# Altium project Trigger.PrjPCB
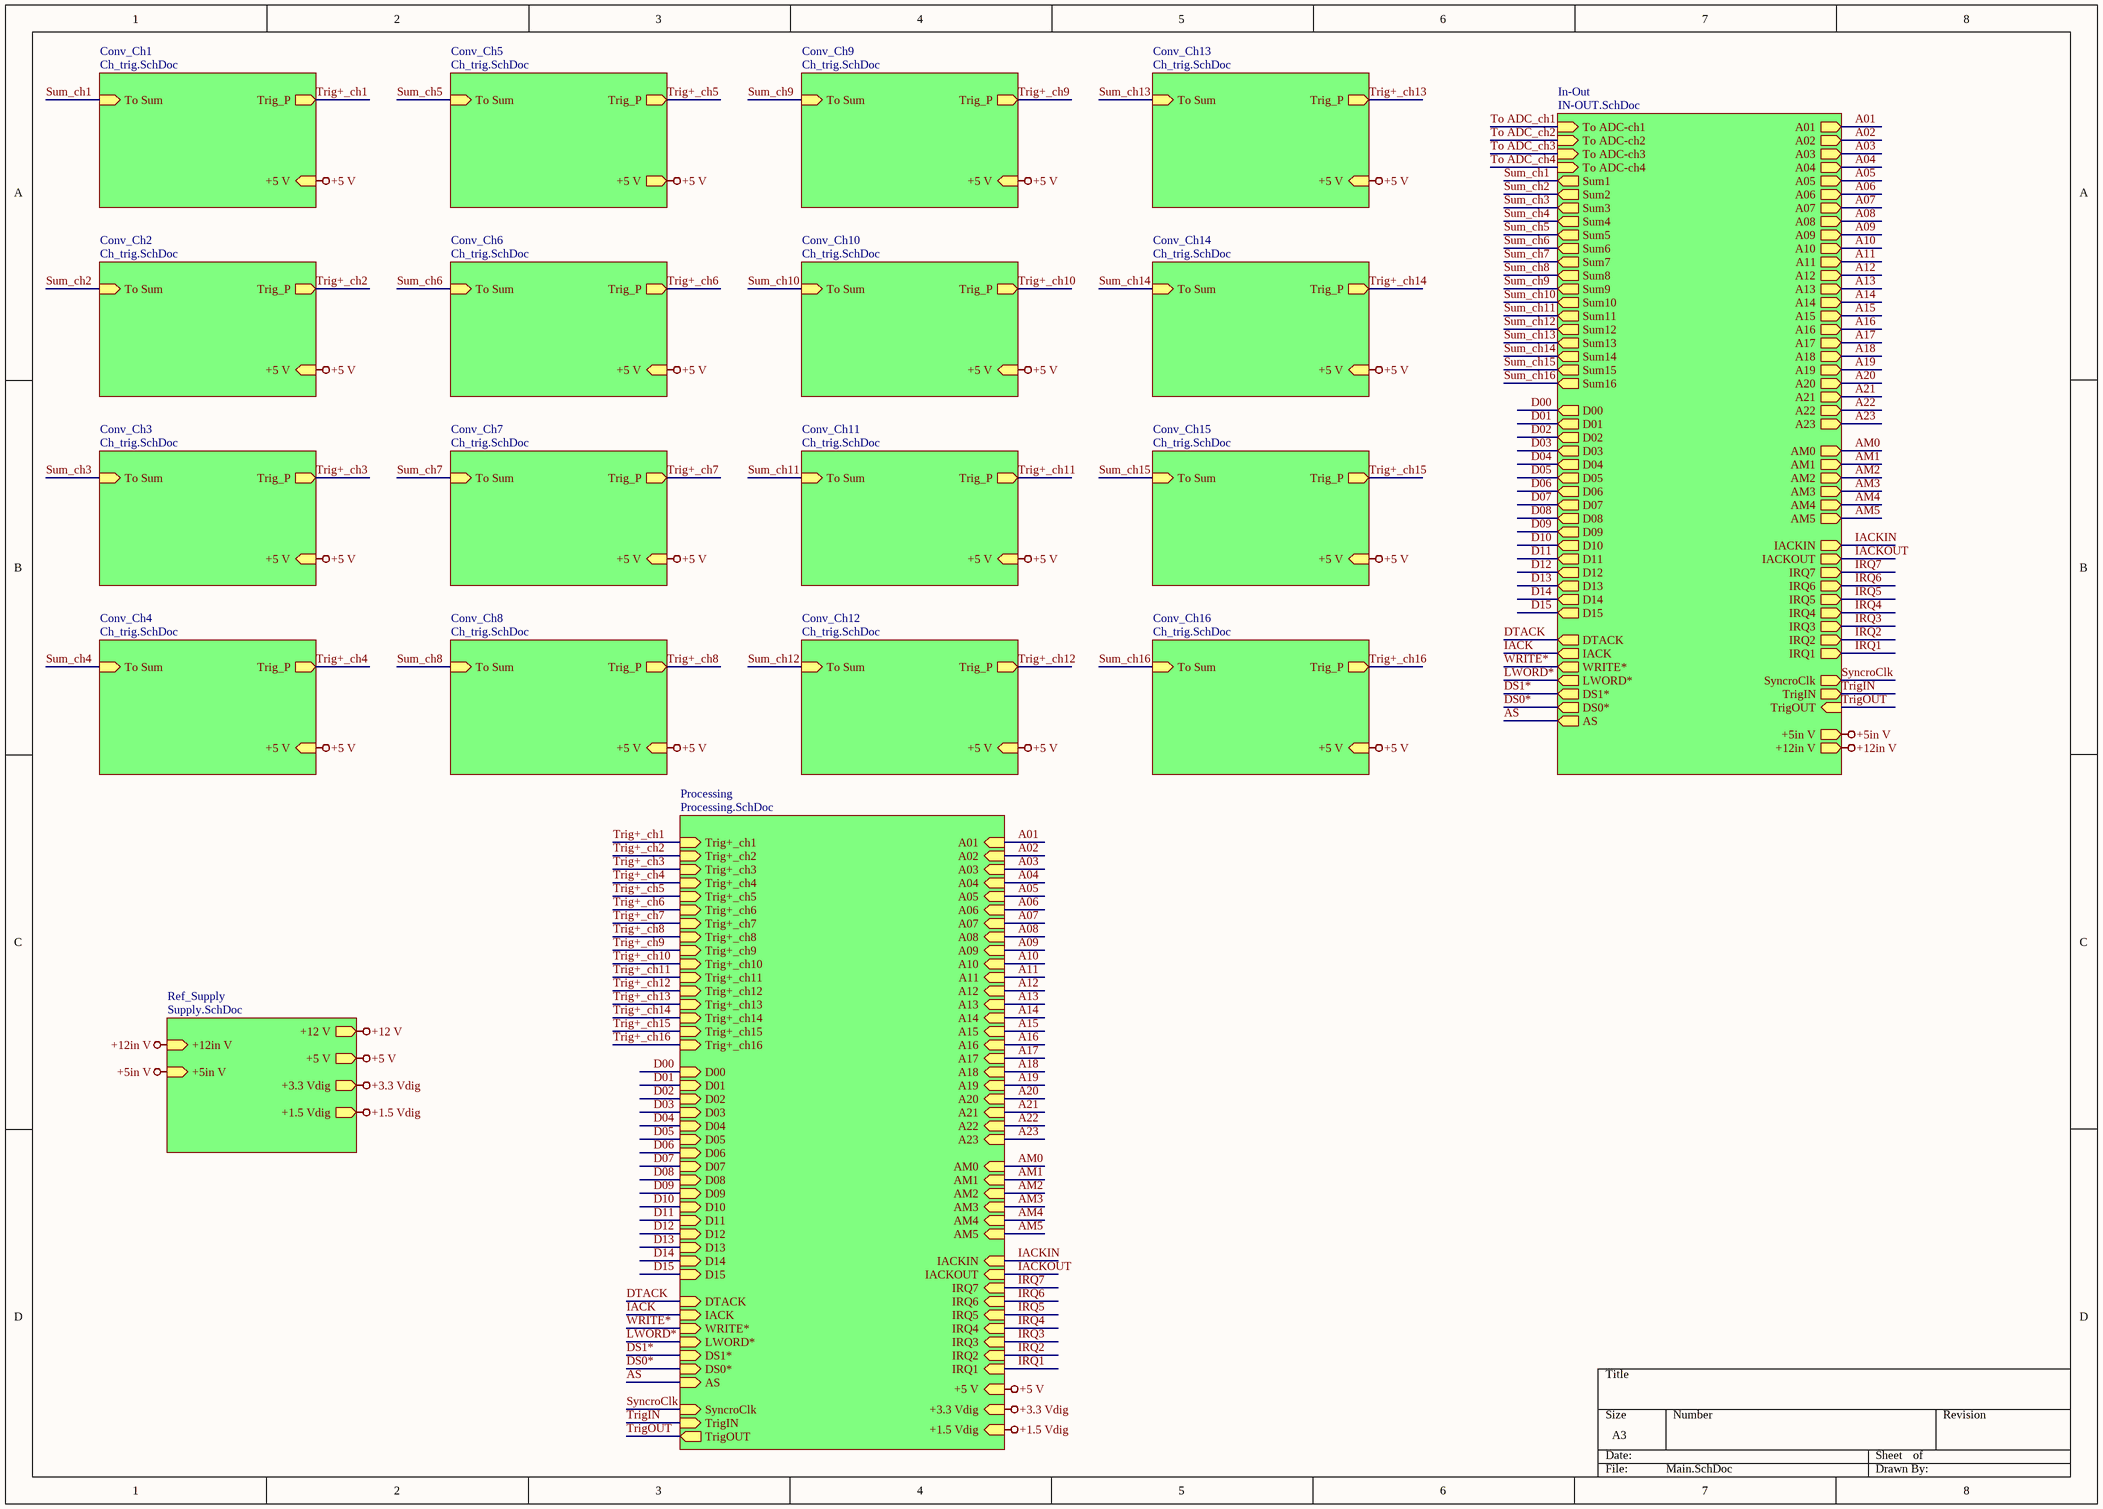
[diagram p0: Main.SchDoc]
5 sheets, 190 parts. Net scope: hierarchical (ports join the sheet entries above them; power ports are global).
Board file: Trigger.PcbDoc
Sheets:
  Main.SchDoc
    Ref_Supply = Supply.SchDoc
    In-Out = In-Out.SchDoc
    Conv_Ch1 = Ch_trig.SchDoc
    Conv_Ch2 = Ch_trig.SchDoc
    Conv_Ch3 = Ch_trig.SchDoc
    Conv_Ch4 = Ch_trig.SchDoc
    Processing = Processing.SchDoc
    Conv_Ch5 = Ch_trig.SchDoc
    Conv_Ch6 = Ch_trig.SchDoc
    Conv_Ch7 = Ch_trig.SchDoc
    Conv_Ch8 = Ch_trig.SchDoc
    Conv_Ch9 = Ch_trig.SchDoc
    Conv_Ch10 = Ch_trig.SchDoc
    Conv_Ch11 = Ch_trig.SchDoc
    Conv_Ch12 = Ch_trig.SchDoc
    Conv_Ch13 = Ch_trig.SchDoc
    Conv_Ch14 = Ch_trig.SchDoc
    Conv_Ch15 = Ch_trig.SchDoc
    Conv_Ch16 = Ch_trig.SchDoc

## Sheet Main.SchDoc
size A3

### Sub-sheets
Conv_Ch1 = Ch_trig.SchDoc: To Sum (in), Trig_P (out), +5 V (in)
Conv_Ch2 = Ch_trig.SchDoc: To Sum (in), Trig_P (out), +5 V (in)
Conv_Ch3 = Ch_trig.SchDoc: To Sum (in), Trig_P (out), +5 V (in)
Conv_Ch4 = Ch_trig.SchDoc: To Sum (in), Trig_P (out), +5 V (in)
Conv_Ch5 = Ch_trig.SchDoc: To Sum (in), Trig_P (out), +5 V (out)
Conv_Ch6 = Ch_trig.SchDoc: To Sum (in), Trig_P (out), +5 V (in)
Conv_Ch7 = Ch_trig.SchDoc: To Sum (in), Trig_P (out), +5 V (in)
Conv_Ch8 = Ch_trig.SchDoc: To Sum (in), Trig_P (out), +5 V (in)
Conv_Ch9 = Ch_trig.SchDoc: To Sum (in), Trig_P (out), +5 V (in)
Conv_Ch10 = Ch_trig.SchDoc: To Sum (in), Trig_P (out), +5 V (in)
Conv_Ch11 = Ch_trig.SchDoc: To Sum (in), Trig_P (out), +5 V (in)
Conv_Ch12 = Ch_trig.SchDoc: To Sum (in), Trig_P (out), +5 V (in)
Conv_Ch13 = Ch_trig.SchDoc: To Sum (in), Trig_P (out), +5 V (in)
Conv_Ch14 = Ch_trig.SchDoc: To Sum (in), Trig_P (out), +5 V (in)
Conv_Ch15 = Ch_trig.SchDoc: To Sum (in), Trig_P (out), +5 V (in)
Conv_Ch16 = Ch_trig.SchDoc: To Sum (in), Trig_P (out), +5 V (in)
In-Out = IN-OUT.SchDoc: To ADC-ch1 (in), To ADC-ch2 (in), To ADC-ch3 (in), To ADC-ch4 (in), Sum4 (out), Sum3 (out), Sum2 (out), Sum1 (out), Sum8 (out), Sum7 (out), Sum6 (out), Sum5 (out), Sum12 (out), Sum11 (out), Sum10 (out), Sum9 (out), Sum16 (out), Sum15 (out), Sum14 (out), Sum13 (out), A01 (out), A02 (out), A03 (out), A04 (out), A05 (out), A06 (out), A07 (out), A08 (out), A09 (out), A10 (out), A11 (out), A12 (out), A13 (out), A14 (out), A15 (out), A16 (out), A18 (out), A19 (out), A20 (out), A21 (out), A22 (out), A23 (out), IRQ7 (out), AM0 (out), AM1 (out), AM2 (out), AM3 (out), AM4 (out), AM5 (out), IRQ6 (out), IACKIN (out), IACKOUT (out), IRQ4 (out), IRQ3 (out), IRQ2 (out), IRQ1 (out), +5in V (out), +12in V (out), IRQ5 (out), A17 (out), D01 (out), D02 (out), D03 (out), D04 (out), D05 (out), D06 (out), D07 (out), D08 (out), D09 (out), D00 (out), D11 (out), D12 (out), D13 (out), D14 (out), D15 (out), D10 (out), DTACK (out), IACK (out), WRITE* (out), LWORD* (out), DS1* (out), DS0* (out), AS (out), TrigOUT (in), SyncroClk (out), TrigIN (out)
Processing = Processing.SchDoc: Trig+_ch1 (in), Trig+_ch2 (in), Trig+_ch3 (in), Trig+_ch4 (in), Trig+_ch5 (in), Trig+_ch6 (in), Trig+_ch7 (in), Trig+_ch8 (in), Trig+_ch9 (in), Trig+_ch10 (in), Trig+_ch11 (in), Trig+_ch12 (in), Trig+_ch13 (in), Trig+_ch14 (in), Trig+_ch15 (in), Trig+_ch16 (in), D01 (in), D02 (in), D03 (in), D04 (in), D05 (in), D06 (in), D07 (in), D08 (in), D09 (in), D00 (in), D11 (in), D12 (in), D13 (in), D14 (in), D15 (in), D10 (in), A01 (in), A02 (in), A03 (in), A04 (in), A05 (in), A06 (in), A07 (in), A08 (in), A09 (in), A10 (in), A11 (in), A12 (in), A13 (in), A14 (in), A15 (in), A16 (in), A18 (in), A19 (in), A20 (in), A21 (in), A22 (in), A23 (in), IRQ7 (in), AM0 (in), AM1 (in), AM2 (in), AM3 (in), AM4 (in), AM5 (in), IRQ6 (in), IACKIN (in), IACKOUT (in), DTACK (in), IACK (in), WRITE* (in), LWORD* (in), DS1* (in), DS0* (in), AS (in), IRQ4 (in), IRQ3 (in), IRQ2 (in), IRQ1 (in), +1.5 Vdig (in), +5 V (in), +3.3 Vdig (in), IRQ5 (in), A17 (in), TrigOUT (out), SyncroClk (in), TrigIN (in)
Ref_Supply = Supply.SchDoc: +1.5 Vdig (out), +5 V (out), +3.3 Vdig (out), +12 V (out), +5in V (in), +12in V (in)

### Nets
+1.5 Vdig: sheet Ref_Supply/+1.5 Vdig, sheet Processing/+1.5 Vdig
+3.3 Vdig: sheet Ref_Supply/+3.3 Vdig, sheet Processing/+3.3 Vdig
+5 V: sheet Ref_Supply/+5 V, sheet Conv_Ch1/+5 V, sheet Conv_Ch2/+5 V, sheet Conv_Ch3/+5 V, sheet Conv_Ch4/+5 V, sheet Processing/+5 V, sheet Conv_Ch5/+5 V, sheet Conv_Ch6/+5 V, sheet Conv_Ch7/+5 V, sheet Conv_Ch8/+5 V, sheet Conv_Ch9/+5 V, sheet Conv_Ch10/+5 V, sheet Conv_Ch11/+5 V, sheet Conv_Ch12/+5 V, sheet Conv_Ch13/+5 V, sheet Conv_Ch14/+5 V, sheet Conv_Ch15/+5 V, sheet Conv_Ch16/+5 V
+5in V: sheet Ref_Supply/+5in V, sheet In-Out/+5in V
+12in V: sheet Ref_Supply/+12in V, sheet In-Out/+12in V
A01: sheet In-Out/A01, sheet Processing/A01
A02: sheet In-Out/A02, sheet Processing/A02
A03: sheet In-Out/A03, sheet Processing/A03
A04: sheet In-Out/A04, sheet Processing/A04
A05: sheet In-Out/A05, sheet Processing/A05
A06: sheet In-Out/A06, sheet Processing/A06
A07: sheet In-Out/A07, sheet Processing/A07
A08: sheet In-Out/A08, sheet Processing/A08
A09: sheet In-Out/A09, sheet Processing/A09
A10: sheet In-Out/A10, sheet Processing/A10
A11: sheet In-Out/A11, sheet Processing/A11
A12: sheet In-Out/A12, sheet Processing/A12
A13: sheet In-Out/A13, sheet Processing/A13
A14: sheet In-Out/A14, sheet Processing/A14
A15: sheet In-Out/A15, sheet Processing/A15
A16: sheet In-Out/A16, sheet Processing/A16
A17: sheet In-Out/A17, sheet Processing/A17
A18: sheet In-Out/A18, sheet Processing/A18
A19: sheet In-Out/A19, sheet Processing/A19
A20: sheet In-Out/A20, sheet Processing/A20
A21: sheet In-Out/A21, sheet Processing/A21
A22: sheet In-Out/A22, sheet Processing/A22
A23: sheet In-Out/A23, sheet Processing/A23
AM0: sheet In-Out/AM0, sheet Processing/AM0
AM1: sheet In-Out/AM1, sheet Processing/AM1
AM2: sheet In-Out/AM2, sheet Processing/AM2
AM3: sheet In-Out/AM3, sheet Processing/AM3
AM4: sheet In-Out/AM4, sheet Processing/AM4
AM5: sheet In-Out/AM5, sheet Processing/AM5
AS: sheet In-Out/AS, sheet Processing/AS
D00: sheet In-Out/D00, sheet Processing/D00
D01: sheet In-Out/D01, sheet Processing/D01
D02: sheet In-Out/D02, sheet Processing/D02
D03: sheet In-Out/D03, sheet Processing/D03
D04: sheet In-Out/D04, sheet Processing/D04
D05: sheet In-Out/D05, sheet Processing/D05
D06: sheet In-Out/D06, sheet Processing/D06
D07: sheet In-Out/D07, sheet Processing/D07
D08: sheet In-Out/D08, sheet Processing/D08
D09: sheet In-Out/D09, sheet Processing/D09
D10: sheet In-Out/D10, sheet Processing/D10
D11: sheet In-Out/D11, sheet Processing/D11
D12: sheet In-Out/D12, sheet Processing/D12
D13: sheet In-Out/D13, sheet Processing/D13
D14: sheet In-Out/D14, sheet Processing/D14
D15: sheet In-Out/D15, sheet Processing/D15
DS0*: sheet In-Out/DS0*, sheet Processing/DS0*
DS1*: sheet In-Out/DS1*, sheet Processing/DS1*
DTACK: sheet In-Out/DTACK, sheet Processing/DTACK
IACK: sheet In-Out/IACK, sheet Processing/IACK
IACKIN: sheet In-Out/IACKIN, sheet Processing/IACKIN
IACKOUT: sheet In-Out/IACKOUT, sheet Processing/IACKOUT
IRQ1: sheet In-Out/IRQ1, sheet Processing/IRQ1
IRQ2: sheet In-Out/IRQ2, sheet Processing/IRQ2
IRQ3: sheet In-Out/IRQ3, sheet Processing/IRQ3
IRQ4: sheet In-Out/IRQ4, sheet Processing/IRQ4
IRQ5: sheet In-Out/IRQ5, sheet Processing/IRQ5
IRQ6: sheet In-Out/IRQ6, sheet Processing/IRQ6
IRQ7: sheet In-Out/IRQ7, sheet Processing/IRQ7
LWORD*: sheet In-Out/LWORD*, sheet Processing/LWORD*
Sum_ch1: sheet In-Out/Sum1, sheet Conv_Ch1/To Sum
Sum_ch2: sheet In-Out/Sum2, sheet Conv_Ch2/To Sum
Sum_ch3: sheet In-Out/Sum3, sheet Conv_Ch3/To Sum
Sum_ch4: sheet In-Out/Sum4, sheet Conv_Ch4/To Sum
Sum_ch5: sheet In-Out/Sum5, sheet Conv_Ch5/To Sum
Sum_ch6: sheet In-Out/Sum6, sheet Conv_Ch6/To Sum
Sum_ch7: sheet In-Out/Sum7, sheet Conv_Ch7/To Sum
Sum_ch8: sheet In-Out/Sum8, sheet Conv_Ch8/To Sum
Sum_ch9: sheet In-Out/Sum9, sheet Conv_Ch9/To Sum
Sum_ch10: sheet In-Out/Sum10, sheet Conv_Ch10/To Sum
Sum_ch11: sheet In-Out/Sum11, sheet Conv_Ch11/To Sum
Sum_ch12: sheet In-Out/Sum12, sheet Conv_Ch12/To Sum
Sum_ch13: sheet In-Out/Sum13, sheet Conv_Ch13/To Sum
Sum_ch14: sheet In-Out/Sum14, sheet Conv_Ch14/To Sum
Sum_ch15: sheet In-Out/Sum15, sheet Conv_Ch15/To Sum
Sum_ch16: sheet In-Out/Sum16, sheet Conv_Ch16/To Sum
SyncroClk: sheet In-Out/SyncroClk, sheet Processing/SyncroClk
To ADC_ch1: sheet In-Out/To ADC-ch1
To ADC_ch2: sheet In-Out/To ADC-ch2
To ADC_ch3: sheet In-Out/To ADC-ch3
To ADC_ch4: sheet In-Out/To ADC-ch4
Trig+_ch1: sheet Conv_Ch1/Trig_P, sheet Processing/Trig+_ch1
Trig+_ch2: sheet Conv_Ch2/Trig_P, sheet Processing/Trig+_ch2
Trig+_ch3: sheet Conv_Ch3/Trig_P, sheet Processing/Trig+_ch3
Trig+_ch4: sheet Conv_Ch4/Trig_P, sheet Processing/Trig+_ch4
Trig+_ch5: sheet Processing/Trig+_ch5, sheet Conv_Ch5/Trig_P
Trig+_ch6: sheet Processing/Trig+_ch6, sheet Conv_Ch6/Trig_P
Trig+_ch7: sheet Processing/Trig+_ch7, sheet Conv_Ch7/Trig_P
Trig+_ch8: sheet Processing/Trig+_ch8, sheet Conv_Ch8/Trig_P
Trig+_ch9: sheet Processing/Trig+_ch9, sheet Conv_Ch9/Trig_P
Trig+_ch10: sheet Processing/Trig+_ch10, sheet Conv_Ch10/Trig_P
Trig+_ch11: sheet Processing/Trig+_ch11, sheet Conv_Ch11/Trig_P
Trig+_ch12: sheet Processing/Trig+_ch12, sheet Conv_Ch12/Trig_P
Trig+_ch13: sheet Processing/Trig+_ch13, sheet Conv_Ch13/Trig_P
Trig+_ch14: sheet Processing/Trig+_ch14, sheet Conv_Ch14/Trig_P
Trig+_ch15: sheet Processing/Trig+_ch15, sheet Conv_Ch15/Trig_P
Trig+_ch16: sheet Processing/Trig+_ch16, sheet Conv_Ch16/Trig_P
TrigIN: sheet In-Out/TrigIN, sheet Processing/TrigIN
TrigOUT: sheet In-Out/TrigOUT, sheet Processing/TrigOUT
WRITE*: sheet In-Out/WRITE*, sheet Processing/WRITE*

## Sheet Supply.SchDoc
size A4
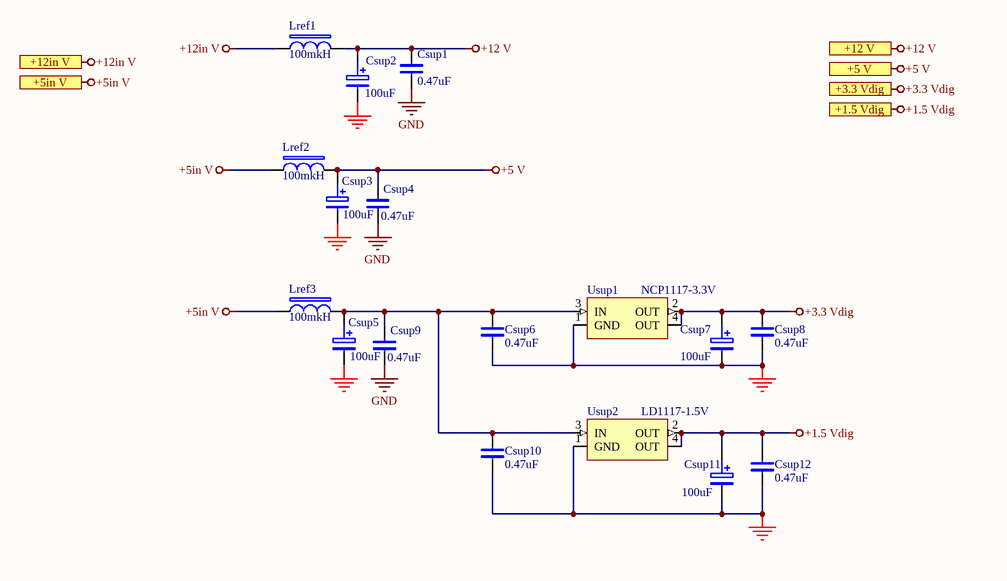
[diagram p1: Supply.SchDoc]

### Parts
Csup1  0.47uF  [chip0805]
Csup2  100uF  [CEL-SMD300]
Csup3  100uF  [CEL-SMD300]
Csup4  0.47uF  [chip0805]
Csup5  100uF  [CEL-SMD300]
Csup6  0.47uF  [chip0805]
Csup7  100uF  [CEL-SMD300]
Csup8  0.47uF  [chip0805]
Csup9  0.47uF  [chip0805]
Csup10  0.47uF  [chip0805]
Csup11  100uF  [CEL-SMD300]
Csup12  0.47uF  [chip0805]
Lref1  100mkH  [SDR0604]
Lref2  100mkH  [SDR0604]
Lref3  100mkH  [SDR0604]
Usup1  NCP1117-3.3V  [TO-252]
Usup2  LD1117-1.5V  [TO-252]

### Ports
+1.5 Vdig (out), +3.3 Vdig (out), +5 V (out), +5in V (in), +12 V (out), +12in V (in)

### Nets
+1.5 Vdig: Csup11.+ Csup12.1 Usup2.2(OUT) Usup2.4(OUT) ; port +1.5 Vdig
+3.3 Vdig: Csup7.+ Csup8.1 Usup1.2(OUT) Usup1.4(OUT) ; port +3.3 Vdig
+5 V: Csup3.+ Csup4.1 Lref2.2 ; port +5 V
+5in V: Lref2.1 Lref3.1 ; port +5in V
+12 V: Csup1.1 Csup2.+ Lref1.2 ; port +12 V
+12in V: Lref1.1 ; port +12in V
GND: Csup1.2 Csup2.- Csup3.- Csup4.2 Csup5.- Csup6.2 Csup7.- Csup8.2 Csup9.2 Csup10.2 Csup11.- Csup12.2 Usup1.1(GND) Usup2.1(GND)
NetCsup5_+: Csup5.+ Csup6.1 Csup9.1 Csup10.1 Lref3.2 Usup1.3(IN) Usup2.3(IN)

### Library data of the parts
Csup1 Csup4 Csup6 Csup8-Csup10 Csup12 = C: Text Field1: 20; Text Field2: 10
Csup2 Csup3 Csup5 Csup7 Csup11 = C POL: Text Field1: 20; Text Field2: 20
Lref1-Lref3 = DR: Text Field1: 30; Text Field2: 10
Usup2 = NCP1117-3.3V

## Sheet In-Out.SchDoc
size A4
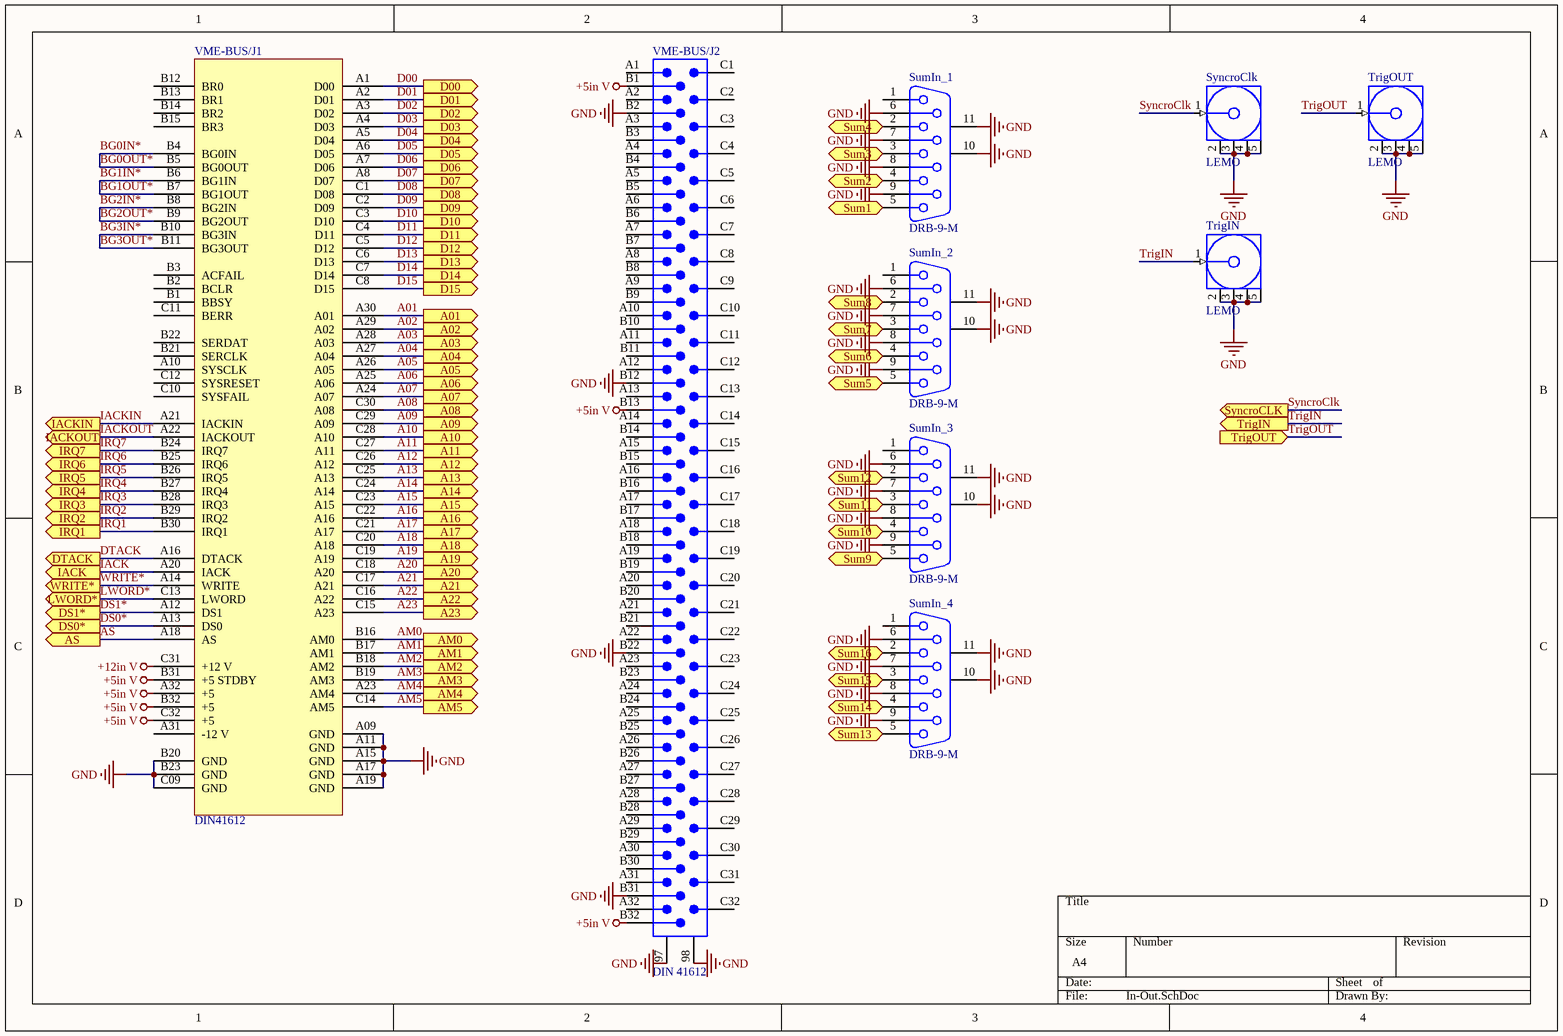
[diagram p2: In-Out.SchDoc]

### Parts
SumIn_1  DRB-9-M  [DSUB1.385-2H9]
SumIn_2  DRB-9-M  [DSUB1.385-2H9]
SumIn_3  DRB-9-M  [DSUB1.385-2H9]
SumIn_4  DRB-9-M  [DSUB1.385-2H9]
SyncroClk  LEMO  [LEMO]
TrigIN  LEMO  [LEMO]
TrigOUT  LEMO  [LEMO]
VME-BUS/J1  DIN41612  [EURO2.54-2H96]
VME-BUS/J2  DIN 41612  [EURO2.54-2H96]

### Ports
A01 (out), A02 (out), A03 (out), A04 (out), A05 (out), A06 (out), A07 (out), A08 (out), A09 (out), A10 (out), A11 (out), A12 (out), A13 (out), A14 (out), A15 (out), A16 (out), A17 (out), A18 (out), A19 (out), A20 (out), A21 (out), A22 (out), A23 (out), AM0 (out), AM1 (out), AM2 (out), AM3 (out), AM4 (out), AM5 (out), AS (out), D00 (out), D01 (out), D02 (out), D03 (out), D04 (out), D05 (out), D06 (out), D07 (out), D08 (out), D09 (out), D10 (out), D11 (out), D12 (out), D13 (out), D14 (out), D15 (out), DS0* (out), DS1* (out), DTACK (out), IACK (out), IACKIN (out), IACKOUT (out), IRQ1 (out), IRQ2 (out), IRQ3 (out), IRQ4 (out), IRQ5 (out), IRQ6 (out), IRQ7 (out), LWORD* (out), Sum1 (out), Sum2 (out), Sum3 (out), Sum4 (out), Sum5 (out), Sum6 (out), Sum7 (out), Sum8 (out), Sum9 (out), Sum10 (out), Sum11 (out), Sum12 (out), Sum13 (out), Sum14 (out), Sum15 (out), Sum16 (out), SyncroCLK (out), TrigIN (out), TrigOUT (in), WRITE* (out)

### Nets
+5in V: VME-BUS/J1.A32(+5) VME-BUS/J1.B31(+5_STDBY) VME-BUS/J1.B32(+5) VME-BUS/J1.C32(+5) VME-BUS/J2.B1 VME-BUS/J2.B13 VME-BUS/J2.B32
+12in V: VME-BUS/J1.C31(+12_V)
GND: SumIn_1.6 SumIn_1.7 SumIn_1.8 SumIn_1.9 SumIn_1.10(MH1) SumIn_1.11(MH2) SumIn_2.6 SumIn_2.7 SumIn_2.8 SumIn_2.9 SumIn_2.10(MH1) SumIn_2.11(MH2) SumIn_3.6 SumIn_3.7 SumIn_3.8 SumIn_3.9 SumIn_3.10(MH1) SumIn_3.11(MH2) SumIn_4.6 SumIn_4.7 SumIn_4.8 SumIn_4.9 SumIn_4.10(MH1) SumIn_4.11(MH2) SyncroClk.2(GND) SyncroClk.3(GND) SyncroClk.4(GND) SyncroClk.5(GND) TrigIN.2(GND) TrigIN.3(GND) TrigIN.4(GND) TrigIN.5(GND) TrigOUT.2(GND) TrigOUT.3(GND) TrigOUT.4(GND) TrigOUT.5(GND) VME-BUS/J1.A09(GND) VME-BUS/J1.A11(GND) VME-BUS/J1.A15(GND) VME-BUS/J1.A17(GND) VME-BUS/J1.A19(GND) VME-BUS/J1.B20(GND) VME-BUS/J1.B23(GND) VME-BUS/J1.C09(GND) VME-BUS/J2.97 VME-BUS/J2.98 VME-BUS/J2.B2 VME-BUS/J2.B12 VME-BUS/J2.B22 VME-BUS/J2.B31
A01: VME-BUS/J1.A30(A01) ; port A01
A02: VME-BUS/J1.A29(A02) ; port A02
A03: VME-BUS/J1.A28(A03) ; port A03
A04: VME-BUS/J1.A27(A04) ; port A04
A05: VME-BUS/J1.A26(A05) ; port A05
A06: VME-BUS/J1.A25(A06) ; port A06
A07: VME-BUS/J1.A24(A07) ; port A07
A08: VME-BUS/J1.C30(A08) ; port A08
A09: VME-BUS/J1.C29(A09) ; port A09
A10: VME-BUS/J1.C28(A10) ; port A10
A11: VME-BUS/J1.C27(A11) ; port A11
A12: VME-BUS/J1.C26(A12) ; port A12
A13: VME-BUS/J1.C25(A13) ; port A13
A14: VME-BUS/J1.C24(A14) ; port A14
A15: VME-BUS/J1.C23(A15) ; port A15
A16: VME-BUS/J1.C22(A16) ; port A16
A17: VME-BUS/J1.C21(A17) ; port A17
A18: VME-BUS/J1.C20(A18) ; port A18
A19: VME-BUS/J1.C19(A19) ; port A19
A20: VME-BUS/J1.C18(A20) ; port A20
A21: VME-BUS/J1.C17(A21) ; port A21
A22: VME-BUS/J1.C16(A22) ; port A22
A23: VME-BUS/J1.C15(A23) ; port A23
AM0: VME-BUS/J1.B16(AM0) ; port AM0
AM1: VME-BUS/J1.B17(AM1) ; port AM1
AM2: VME-BUS/J1.B18(AM2) ; port AM2
AM3: VME-BUS/J1.B19(AM3) ; port AM3
AM4: VME-BUS/J1.A23(AM4) ; port AM4
AM5: VME-BUS/J1.C14(AM5) ; port AM5
AS: VME-BUS/J1.A18(AS) ; port AS
BG0IN*: VME-BUS/J1.B4(BG0IN) VME-BUS/J1.B5(BG0OUT)  [also labelled BG0OUT*]
BG1IN*: VME-BUS/J1.B6(BG1IN) VME-BUS/J1.B7(BG1OUT)  [also labelled BG1OUT*]
BG2IN*: VME-BUS/J1.B8(BG2IN) VME-BUS/J1.B9(BG2OUT)  [also labelled BG2OUT*]
BG3IN*: VME-BUS/J1.B10(BG3IN) VME-BUS/J1.B11(BG3OUT)  [also labelled BG3OUT*]
D00: VME-BUS/J1.A1(D00) ; port D00
D01: VME-BUS/J1.A2(D01) ; port D01
D02: VME-BUS/J1.A3(D02) ; port D02
D03: VME-BUS/J1.A4(D03) ; port D03
D04: VME-BUS/J1.A5(D04) ; port D04
D05: VME-BUS/J1.A6(D05) ; port D05
D06: VME-BUS/J1.A7(D06) ; port D06
D07: VME-BUS/J1.A8(D07) ; port D07
D08: VME-BUS/J1.C1(D08) ; port D08
D09: VME-BUS/J1.C2(D09) ; port D09
D10: VME-BUS/J1.C3(D10) ; port D10
D11: VME-BUS/J1.C4(D11) ; port D11
D12: VME-BUS/J1.C5(D12) ; port D12
D13: VME-BUS/J1.C6(D13) ; port D13
D14: VME-BUS/J1.C7(D14) ; port D14
D15: VME-BUS/J1.C8(D15) ; port D15
DS0*: VME-BUS/J1.A13(DS0) ; port DS0*
DS1*: VME-BUS/J1.A12(DS1) ; port DS1*
DTACK: VME-BUS/J1.A16(DTACK) ; port DTACK
IACK: VME-BUS/J1.A20(IACK) ; port IACK
IACKIN: VME-BUS/J1.A21(IACKIN) ; port IACKIN
IACKOUT: VME-BUS/J1.A22(IACKOUT) ; port IACKOUT
IRQ1: VME-BUS/J1.B30(IRQ1) ; port IRQ1
IRQ2: VME-BUS/J1.B29(IRQ2) ; port IRQ2
IRQ3: VME-BUS/J1.B28(IRQ3) ; port IRQ3
IRQ4: VME-BUS/J1.B27(IRQ4) ; port IRQ4
IRQ5: VME-BUS/J1.B26(IRQ5) ; port IRQ5
IRQ6: VME-BUS/J1.B25(IRQ6) ; port IRQ6
IRQ7: VME-BUS/J1.B24(IRQ7) ; port IRQ7
LWORD*: VME-BUS/J1.C13(LWORD) ; port LWORD*
Sum_ch1: SumIn_1.5 ; port Sum1
Sum_ch2: SumIn_1.4 ; port Sum2
Sum_ch3: SumIn_1.3 ; port Sum3
Sum_ch4: SumIn_1.2 ; port Sum4
Sum_ch5: SumIn_2.5 ; port Sum5
Sum_ch6: SumIn_2.4 ; port Sum6
Sum_ch7: SumIn_2.3 ; port Sum7
Sum_ch8: SumIn_2.2 ; port Sum8
Sum_ch9: SumIn_3.5 ; port Sum9
Sum_ch10: SumIn_3.4 ; port Sum10
Sum_ch11: SumIn_3.3 ; port Sum11
Sum_ch12: SumIn_3.2 ; port Sum12
Sum_ch13: SumIn_4.5 ; port Sum13
Sum_ch14: SumIn_4.4 ; port Sum14
Sum_ch15: SumIn_4.3 ; port Sum15
Sum_ch16: SumIn_4.2 ; port Sum16
SyncroClk: SyncroClk.1(Signal) ; port SyncroCLK
TrigIN: TrigIN.1(Signal) ; port TrigIN
TrigOUT: TrigOUT.1(Signal) ; port TrigOUT
WRITE*: VME-BUS/J1.A14(WRITE) ; port WRITE*

Not connected (* = marked no-connect by the designer): SumIn_1 1; SumIn_2 1; SumIn_3 1; SumIn_4 1; VME-BUS/J1 A10(SYSCLK) A31(-12_V) B1(BBSY) B2(BCLR) B3(ACFAIL) B12(BR0) B13(BR1) B14(BR2) B15(BR3) B21(SERCLK) B22(SERDAT) C10(SYSFAIL) C11(BERR) C12(SYSRESET); VME-BUS/J2 A1 A2 A3 A4 A5 A6 A7 A8 A9 A10 A11 A12 A13 A14 A15 A16 A17 A18 A19 A20 A21 A22 A23 A24 A25 A26 A27 A28 A29 A30 A31 A32 B3 B4 B5 B6 B7 B8 B9 B10 B11 B14 B15 B16 B17 B18 B19 B20 B21 B23 B24 B25 B26 B27 B28 B29 B30 C1 C2 C3 C4 C5 C6 C7 C8 C9 C10 C11 C12 C13 C14 C15 C16 C17 C18 C19 C20 C21 C22 C23 C24 C25 C26 C27 C28 C29 C30 C31 C32

### Library data of the parts
SumIn_1-SumIn_4 = D Connector 9: Receptacle Assembly, 9 Position, Right Angle; PackageDocument: O; Positions: 9; Published: 15-Jun-2001; LatestRevisionDate: 17-Jul-2002; LatestRevisionNote: Re-released for DXP Platform.; DatasheetDocument: 1-Sep-1999; PackageReference: 788750; Publisher: Altium Limited; Orientation: Right Angle; Gender: Receptacle
SyncroClk TrigIN TrigOUT = COAX-F: RF Coaxial PCB Connector, MCX; Thru-Hole, Right-Angle Mount Socket, Blunt Post Terminal, 50 Ohm Impedance; PCB_Layout: Complies with manufacturer's recommendation.; DrillSize: Corresponds to nominal value.; Published: 15-Jul-2004; LatestRevisionDate: 15-Jul-2004; LatestRevisionNote: Component Replaced.; DatasheetDocument: 30-May-2003; PackageDocument: 04-Jul-1999; PackageReference: 919-119J-51AX; Publisher: Altium Limited; ComponentLink1Description: Manufacturer Link; ComponentLink1URL: http://www.amphenolrf.com/
VME-BUS/J1 = VME-P1/J1
VME-BUS/J2 = CNVME96: 96-Pin Connector (3x32 2.54mm grid); Text Field6: Alternate Layout Available; Text Field7: Published 14-Feb-2002

## Sheet Ch_trig.SchDoc
size A4
Used 16 times, as channels Conv_Ch1, Conv_Ch2, Conv_Ch3, Conv_Ch4, Conv_Ch5, Conv_Ch6, Conv_Ch7, Conv_Ch8, Conv_Ch9, Conv_Ch10, Conv_Ch11, Conv_Ch12, Conv_Ch13, Conv_Ch14, Conv_Ch15, Conv_Ch16. Parts and nets are listed once, with the designators drawn on the sheet.
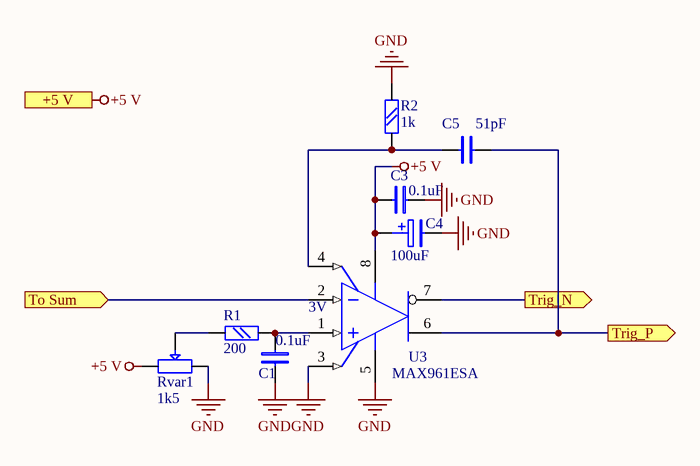
[diagram p3: Ch_trig.SchDoc]

### Parts
C1  0.1uF  [chip0805]
C3  0.1uF  [chip0805]
C4  100uF  [CEL-SMD300]
C5  51pF  [chip0805]
R1  200  [chip0805]
R2  1k  [chip0805]
Rvar1  1k5  [RVAR4]
U3  MAX961ESA  [NSO8_N]

### Ports
+5 V (in), To Sum (in), Trig_N (out), Trig_P (out)

### Nets
+5 V: C3.2 C4.+ Rvar1.1 U3.8(V+) ; port +5 V
GND: C1.1 C3.1 C4.- R2.2 Rvar1.3 U3.3(SHDN) U3.5(GND)
To Sum: U3.2(IN-) ; port To Sum
Trig_N: U3.7(~{Q}) ; port Trig_N
Trig_P: C5.2 U3.6(Q) ; port Trig_P
NetC1_2: C1.2 R1.2 U3.1(IN+)
NetC5_1: C5.1 R2.1 U3.4(LE)
NetR1_1: R1.1 Rvar1.2

### Channels
Conv_Ch1: designators end in _Conv_Ch1; ports +5 V=+5 V To Sum=Sum_ch1 Trig_N=NetU3_Conv_Ch1_7 Trig_P=Trig+_ch1
Conv_Ch2: designators end in _Conv_Ch2; ports +5 V=+5 V To Sum=Sum_ch2 Trig_N=NetU3_Conv_Ch2_7 Trig_P=Trig+_ch2
Conv_Ch3: designators end in _Conv_Ch3; ports +5 V=+5 V To Sum=Sum_ch3 Trig_N=NetU3_Conv_Ch3_7 Trig_P=Trig+_ch3
Conv_Ch4: designators end in _Conv_Ch4; ports +5 V=+5 V To Sum=Sum_ch4 Trig_N=NetU3_Conv_Ch4_7 Trig_P=Trig+_ch4
Conv_Ch5: designators end in _Conv_Ch5; ports +5 V=+5 V To Sum=Sum_ch5 Trig_N=NetU3_Conv_Ch5_7 Trig_P=Trig+_ch5
Conv_Ch6: designators end in _Conv_Ch6; ports +5 V=+5 V To Sum=Sum_ch6 Trig_N=NetU3_Conv_Ch6_7 Trig_P=Trig+_ch6
Conv_Ch7: designators end in _Conv_Ch7; ports +5 V=+5 V To Sum=Sum_ch7 Trig_N=NetU3_Conv_Ch7_7 Trig_P=Trig+_ch7
Conv_Ch8: designators end in _Conv_Ch8; ports +5 V=+5 V To Sum=Sum_ch8 Trig_N=NetU3_Conv_Ch8_7 Trig_P=Trig+_ch8
Conv_Ch9: designators end in _Conv_Ch9; ports +5 V=+5 V To Sum=Sum_ch9 Trig_N=NetU3_Conv_Ch9_7 Trig_P=Trig+_ch9
Conv_Ch10: designators end in _Conv_Ch10; ports +5 V=+5 V To Sum=Sum_ch10 Trig_N=NetU3_Conv_Ch10_7 Trig_P=Trig+_ch10
Conv_Ch11: designators end in _Conv_Ch11; ports +5 V=+5 V To Sum=Sum_ch11 Trig_N=NetU3_Conv_Ch11_7 Trig_P=Trig+_ch11
Conv_Ch12: designators end in _Conv_Ch12; ports +5 V=+5 V To Sum=Sum_ch12 Trig_N=NetU3_Conv_Ch12_7 Trig_P=Trig+_ch12
Conv_Ch13: designators end in _Conv_Ch13; ports +5 V=+5 V To Sum=Sum_ch13 Trig_N=NetU3_Conv_Ch13_7 Trig_P=Trig+_ch13
Conv_Ch14: designators end in _Conv_Ch14; ports +5 V=+5 V To Sum=Sum_ch14 Trig_N=NetU3_Conv_Ch14_7 Trig_P=Trig+_ch14
Conv_Ch15: designators end in _Conv_Ch15; ports +5 V=+5 V To Sum=Sum_ch15 Trig_N=NetU3_Conv_Ch15_7 Trig_P=Trig+_ch15
Conv_Ch16: designators end in _Conv_Ch16; ports +5 V=+5 V To Sum=Sum_ch16 Trig_N=NetU3_Conv_Ch16_7 Trig_P=Trig+_ch16

### Notes on the sheet
- (near U3) 3V

### Library data of the parts
C1 C3 C5 = C: Text Field1: 20; Text Field2: 10
C4 = C POL: Text Field1: 20; Text Field2: 20
R1 R2 = R: Text Field1: 20; Text Field2: 20
Rvar1 = R VAR: Text Field1: 20; Text Field2: 20
U3 = MAX961ESA: Single Ultra-High-Speed, +3V/+5V, Beyond-the-Rails Comparator; Published: 16-Jan-2001; LatestRevisionDate: 13-Apr-2006; LatestRevisionNote: IPC-7351 Footprint Added.; DatasheetVersion: Jan-1998; PackageReference: NSO8; Publisher: Altium Limited; PackageDescription: 8-Pin Small Outline Integrated Circuit 1.27 mm Pitch; Code_JEDEC: MS-012-AA; Code_IPC: SOIC127P600-8; ComponentLink1Description: Manufacturer Link; ComponentLink1URL: http://www.maxim-ic.com/; ComponentLink2Description: Datasheet; ComponentLink2URL: http://pdfserv.maxim-ic.com/en/ds/MAX961-MAX999.pdf

## Sheet Processing.SchDoc
size A3
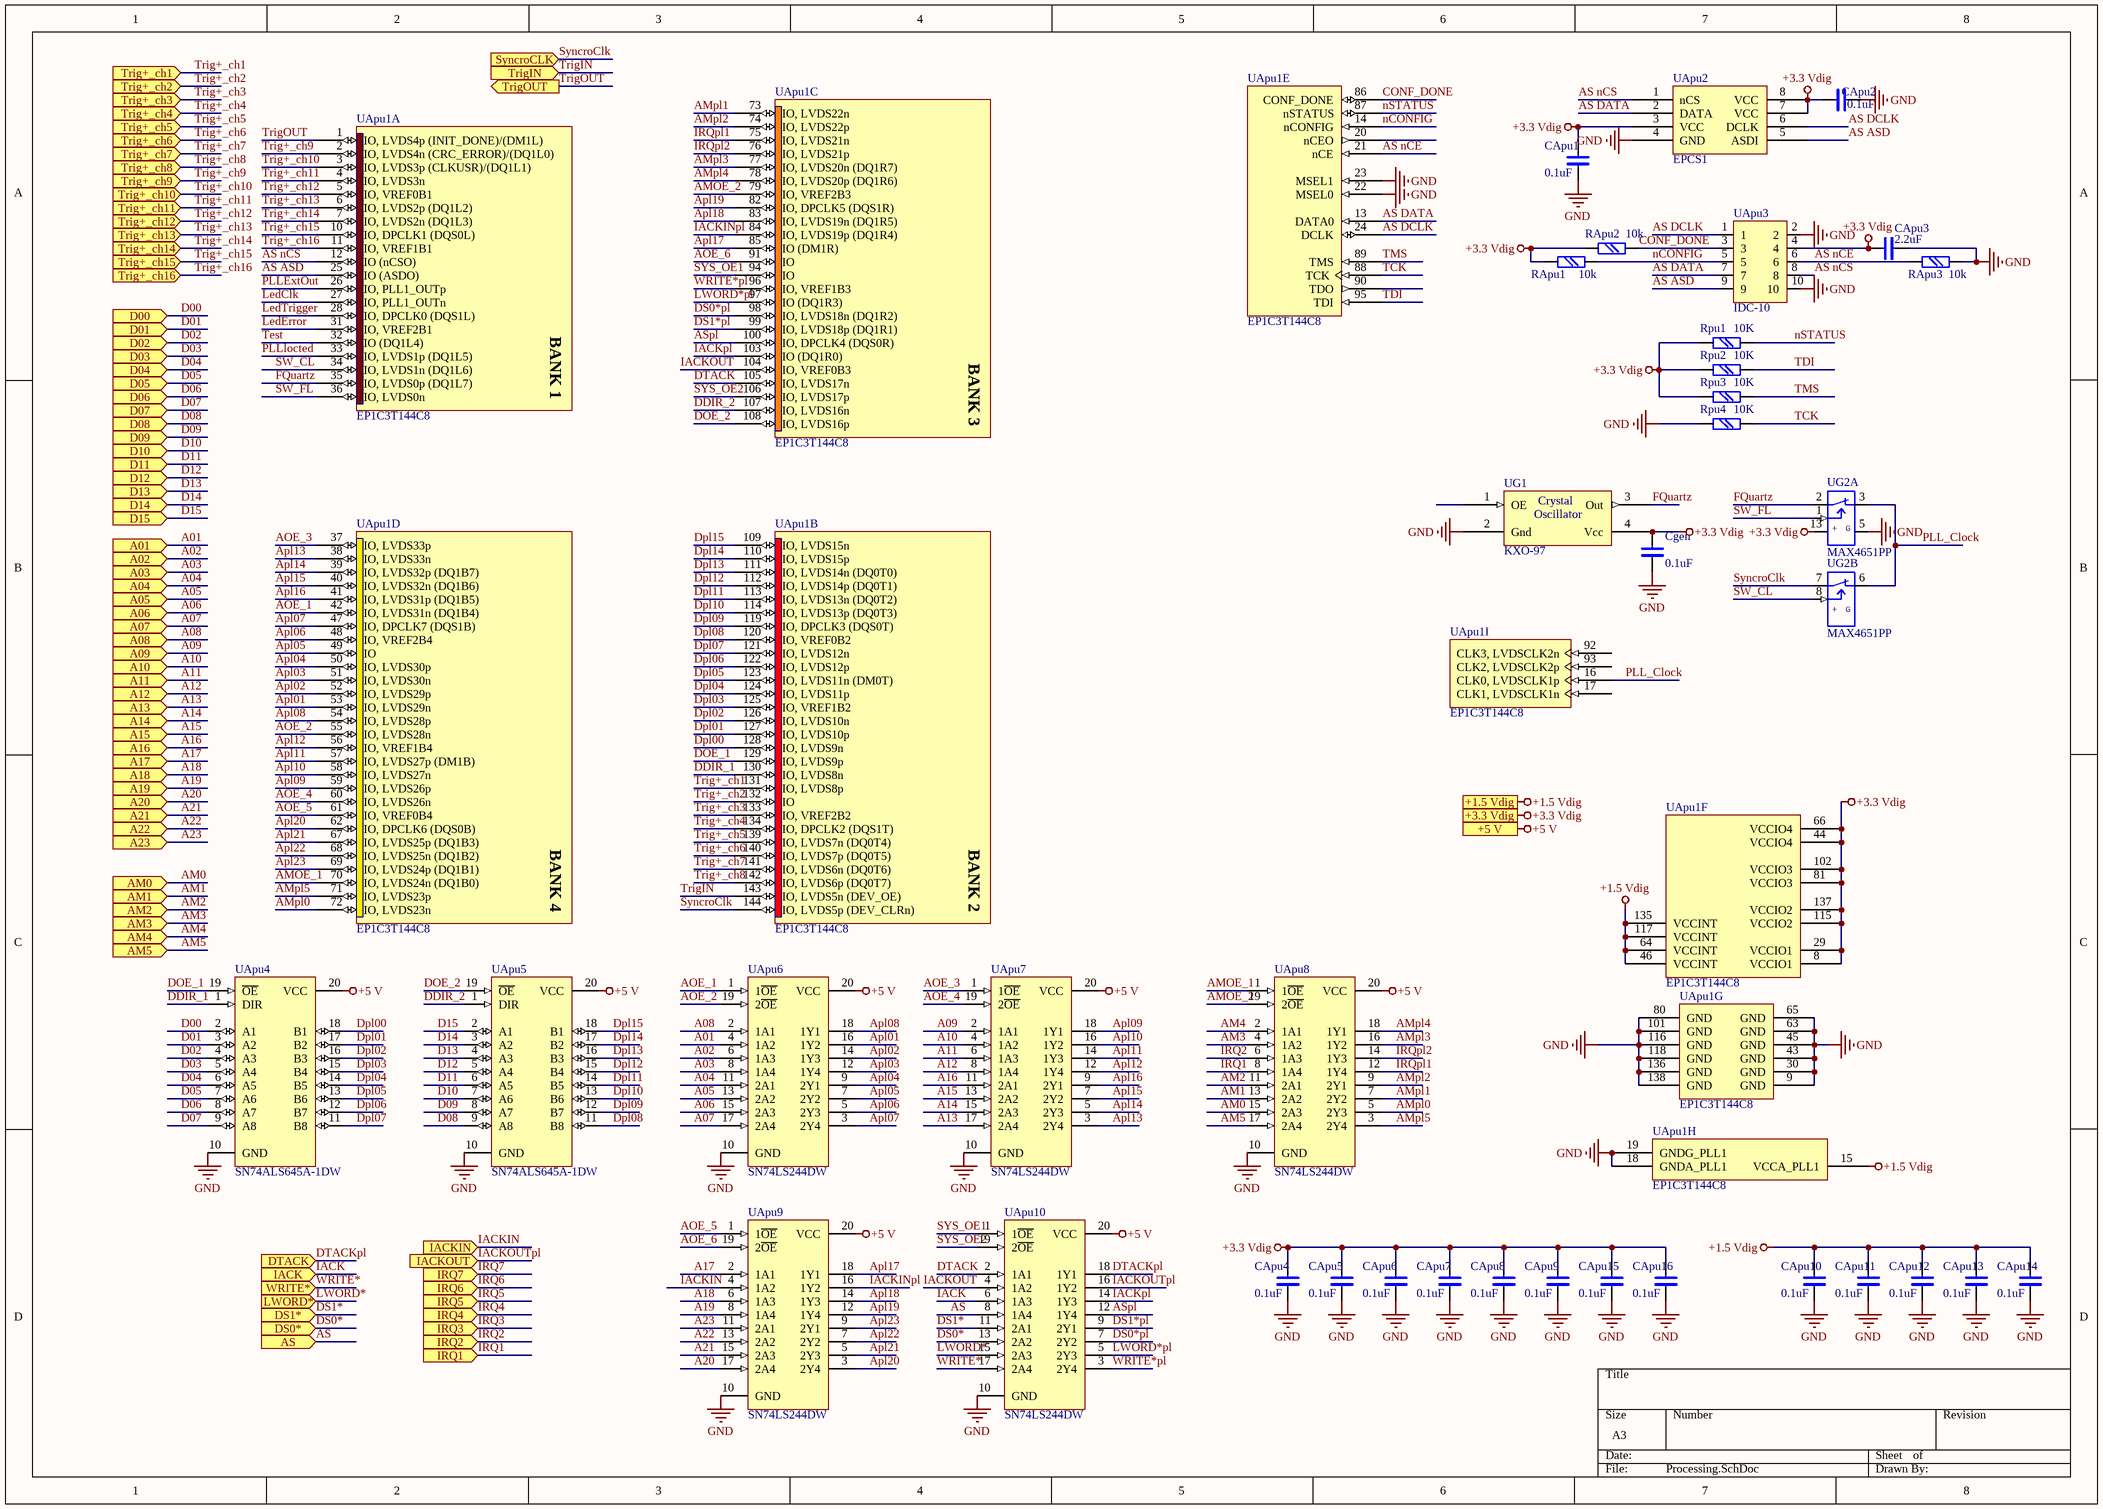
[diagram p4: Processing.SchDoc]

### Parts
CApu1  0.1uF  [chip0805]
CApu2  0.1uF  [chip0805]
CApu3  2.2uF  [chip0805]
CApu4  0.1uF  [chip0805]
CApu5  0.1uF  [chip0805]
CApu6  0.1uF  [chip0805]
CApu7  0.1uF  [chip0805]
CApu8  0.1uF  [chip0805]
CApu9  0.1uF  [chip0805]
CApu10  0.1uF  [chip0805]
CApu11  0.1uF  [chip0805]
CApu12  0.1uF  [chip0805]
CApu13  0.1uF  [chip0805]
CApu14  0.1uF  [chip0805]
CApu15  0.1uF  [chip0805]
CApu16  0.1uF  [chip0805]
Cgen  0.1uF  [chip0805]
RApu1  10k  [chip0805]
RApu2  10k  [chip0805]
RApu3  10k  [chip0805]
Rpu1  10K  [chip0805]
Rpu2  10K  [chip0805]
Rpu3  10K  [chip0805]
Rpu4  10K  [chip0805]
UApu1  EP1C3T144C8  [TQFP144_N]  (parts A,B,C,D,E,F,G,H,I of 9)
UApu2  EPCS1  [8SO200]
UApu3  IDC-10  [IDC10]
UApu4  SN74ALS645A-1DW  [DW020_N]
UApu5  SN74ALS645A-1DW  [DW020_N]
UApu6  SN74LS244DW  [DW020_N]
UApu7  SN74LS244DW  [DW020_N]
UApu8  SN74LS244DW  [DW020_N]
UApu9  SN74LS244DW  [DW020_N]
UApu10  SN74LS244DW  [DW020_N]
UG1  KXO-97  [SG-636]
UG2  MAX4651PP  [16SOIC150]  (parts A,B of 4)

### Ports
+1.5 Vdig (in), +3.3 Vdig (in), +5 V (in), A01 (in), A02 (in), A03 (in), A04 (in), A05 (in), A06 (in), A07 (in), A08 (in), A09 (in), A10 (in), A11 (in), A12 (in), A13 (in), A14 (in), A15 (in), A16 (in), A17 (in), A18 (in), A19 (in), A20 (in), A21 (in), A22 (in), A23 (in), AM0 (in), AM1 (in), AM2 (in), AM3 (in), AM4 (in), AM5 (in), AS (in), D00 (in), D01 (in), D02 (in), D03 (in), D04 (in), D05 (in), D06 (in), D07 (in), D08 (in), D09 (in), D10 (in), D11 (in), D12 (in), D13 (in), D14 (in), D15 (in), DS0* (in), DS1* (in), DTACK (in), IACK (in), IACKIN (in), IACKOUT (in), IRQ1 (in), IRQ2 (in), IRQ3 (in), IRQ4 (in), IRQ5 (in), IRQ6 (in), IRQ7 (in), LWORD* (in), SyncroCLK (in), Trig+_ch1 (in), Trig+_ch2 (in), Trig+_ch3 (in), Trig+_ch4 (in), Trig+_ch5 (in), Trig+_ch6 (in), Trig+_ch7 (in), Trig+_ch8 (in), Trig+_ch9 (in), Trig+_ch10 (in), Trig+_ch11 (in), Trig+_ch12 (in), Trig+_ch13 (in), Trig+_ch14 (in), Trig+_ch15 (in), Trig+_ch16 (in), TrigIN (in), TrigOUT (out), WRITE* (in)

### Nets
+1.5 Vdig: CApu10.2 CApu11.2 CApu12.2 CApu13.2 CApu14.2 UApu1.15(VCCA_PLL1) UApu1.46(VCCINT) UApu1.64(VCCINT) UApu1.117(VCCINT) UApu1.135(VCCINT) ; port +1.5 Vdig
+3.3 Vdig: CApu1.2 CApu2.2 CApu3.1 CApu4.2 CApu5.2 CApu6.2 CApu7.2 CApu8.2 CApu9.2 CApu15.2 CApu16.2 Cgen.2 RApu1.1 RApu2.1 Rpu1.1 Rpu2.1 Rpu3.1 UApu1.8(VCCIO1) UApu1.29(VCCIO1) UApu1.44(VCCIO4) UApu1.66(VCCIO4) UApu1.81(VCCIO3) UApu1.102(VCCIO3) UApu1.115(VCCIO2) UApu1.137(VCCIO2) UApu2.3(VCC) UApu2.7(VCC) UApu2.8(VCC) UApu3.4 UG1.4(Vcc) UG2.13(VCC) ; port +3.3 Vdig
+5 V: UApu4.20(VCC) UApu5.20(VCC) UApu6.20(VCC) UApu7.20(VCC) UApu8.20(VCC) UApu9.20(VCC) UApu10.20(VCC) ; port +5 V
GND: CApu1.1 CApu2.1 CApu3.2 CApu4.1 CApu5.1 CApu6.1 CApu7.1 CApu8.1 CApu9.1 CApu10.1 CApu11.1 CApu12.1 CApu13.1 CApu14.1 CApu15.1 CApu16.1 Cgen.1 RApu3.2 Rpu4.1 UApu1.9(GND) UApu1.18(GNDA_PLL1) UApu1.19(GNDG_PLL1) UApu1.22(MSEL0) UApu1.23(MSEL1) UApu1.30(GND) UApu1.43(GND) UApu1.45(GND) UApu1.63(GND) UApu1.65(GND) UApu1.80(GND) UApu1.101(GND) UApu1.116(GND) UApu1.118(GND) UApu1.136(GND) UApu1.138(GND) UApu2.4(GND) UApu3.2 UApu3.10 UApu4.10(GND) UApu5.10(GND) UApu6.10(GND) UApu7.10(GND) UApu8.10(GND) UApu9.10(GND) UApu10.10(GND) UG1.2(Gnd) UG2.5(GND)
A01: UApu6.4(1A2) ; port A01
A02: UApu6.6(1A3) ; port A02
A03: UApu6.8(1A4) ; port A03
A04: UApu6.11(2A1) ; port A04
A05: UApu6.13(2A2) ; port A05
A06: UApu6.15(2A3) ; port A06
A07: UApu6.17(2A4) ; port A07
A08: UApu6.2(1A1) ; port A08
A09: UApu7.2(1A1) ; port A09
A10: UApu7.4(1A2) ; port A10
A11: UApu7.6(1A3) ; port A11
A12: UApu7.8(1A4) ; port A12
A13: UApu7.17(2A4) ; port A13
A14: UApu7.15(2A3) ; port A14
A15: UApu7.13(2A2) ; port A15
A16: UApu7.11(2A1) ; port A16
A17: UApu9.2(1A1) ; port A17
A18: UApu9.6(1A3) ; port A18
A19: UApu9.8(1A4) ; port A19
A20: UApu9.17(2A4) ; port A20
A21: UApu9.15(2A3) ; port A21
A22: UApu9.13(2A2) ; port A22
A23: UApu9.11(2A1) ; port A23
AM0: UApu8.15(2A3) ; port AM0
AM1: UApu8.13(2A2) ; port AM1
AM2: UApu8.11(2A1) ; port AM2
AM3: UApu8.4(1A2) ; port AM3
AM4: UApu8.2(1A1) ; port AM4
AM5: UApu8.17(2A4) ; port AM5
AMOE_1: UApu1.70(IO,_LVDS24n_(DQ1B0)) UApu8.1(1~{OE})
AMOE_2: UApu1.79(IO,_VREF2B3) UApu8.19(2~{OE})
AMpl0: UApu1.72(IO,_LVDS23n) UApu8.5(2Y3)
AMpl1: UApu1.73(IO,_LVDS22n) UApu8.7(2Y2)
AMpl2: UApu1.74(IO,_LVDS22p) UApu8.9(2Y1)
AMpl3: UApu1.77(IO,_LVDS20n_(DQ1R7)) UApu8.16(1Y2)
AMpl4: UApu1.78(IO,_LVDS20p_(DQ1R6)) UApu8.18(1Y1)
AMpl5: UApu1.71(IO,_LVDS23p) UApu8.3(2Y4)
AOE_1: UApu1.42(IO,_LVDS31n_(DQ1B4)) UApu6.1(1~{OE})
AOE_2: UApu1.55(IO,_LVDS28n) UApu6.19(2~{OE})
AOE_3: UApu1.37(IO,_LVDS33p) UApu7.1(1~{OE})
AOE_4: UApu1.60(IO,_LVDS26n) UApu7.19(2~{OE})
AOE_5: UApu1.61(IO,_VREF0B4) UApu9.1(1~{OE})
AOE_6: UApu1.91(IO) UApu9.19(2~{OE})
Apl01: UApu1.53(IO,_LVDS29n) UApu6.16(1Y2)
Apl02: UApu1.52(IO,_LVDS29p) UApu6.14(1Y3)
Apl03: UApu1.51(IO,_LVDS30n) UApu6.12(1Y4)
Apl04: UApu1.50(IO,_LVDS30p) UApu6.9(2Y1)
Apl05: UApu1.49(IO) UApu6.7(2Y2)
Apl06: UApu1.48(IO,_VREF2B4) UApu6.5(2Y3)
Apl07: UApu1.47(IO,_DPCLK7_(DQS1B)) UApu6.3(2Y4)
Apl08: UApu1.54(IO,_LVDS28p) UApu6.18(1Y1)
Apl09: UApu1.59(IO,_LVDS26p) UApu7.18(1Y1)
Apl10: UApu1.58(IO,_LVDS27n) UApu7.16(1Y2)
Apl11: UApu1.57(IO,_LVDS27p_(DM1B)) UApu7.14(1Y3)
Apl12: UApu1.56(IO,_VREF1B4) UApu7.12(1Y4)
Apl13: UApu1.38(IO,_LVDS33n) UApu7.3(2Y4)
Apl14: UApu1.39(IO,_LVDS32p_(DQ1B7)) UApu7.5(2Y3)
Apl15: UApu1.40(IO,_LVDS32n_(DQ1B6)) UApu7.7(2Y2)
Apl16: UApu1.41(IO,_LVDS31p_(DQ1B5)) UApu7.9(2Y1)
Apl17: UApu1.85(IO_(DM1R)) UApu9.18(1Y1)
Apl18: UApu1.83(IO,_LVDS19n_(DQ1R5)) UApu9.14(1Y3)
Apl19: UApu1.82(IO,_DPCLK5_(DQS1R)) UApu9.12(1Y4)
Apl20: UApu1.62(IO,_DPCLK6_(DQS0B)) UApu9.3(2Y4)
Apl21: UApu1.67(IO,_LVDS25p_(DQ1B3)) UApu9.5(2Y3)
Apl22: UApu1.68(IO,_LVDS25n_(DQ1B2)) UApu9.7(2Y2)
Apl23: UApu1.69(IO,_LVDS24p_(DQ1B1)) UApu9.9(2Y1)
AS: UApu10.8(1A4) ; port AS
AS ASD: UApu1.25(IO_(ASDO)) UApu2.5(ASDI) UApu3.9
AS DATA: UApu1.13(DATA0) UApu2.2(DATA) UApu3.7
AS DCLK: UApu1.24(DCLK) UApu2.6(DCLK) UApu3.1
AS nCE: RApu3.1 UApu1.21(nCE) UApu3.6
AS nCS: UApu1.12(IO_(nCSO)) UApu2.1(nCS) UApu3.8
ASpl: UApu1.100(IO,_DPCLK4_(DQS0R)) UApu10.12(1Y4)
CONF_DONE: RApu2.2 UApu1.86(CONF_DONE) UApu3.3
D00: UApu4.2(A1) ; port D00
D01: UApu4.3(A2) ; port D01
D02: UApu4.4(A3) ; port D02
D03: UApu4.5(A4) ; port D03
D04: UApu4.6(A5) ; port D04
D05: UApu4.7(A6) ; port D05
D06: UApu4.8(A7) ; port D06
D07: UApu4.9(A8) ; port D07
D08: UApu5.9(A8) ; port D08
D09: UApu5.8(A7) ; port D09
D10: UApu5.7(A6) ; port D10
D11: UApu5.6(A5) ; port D11
D12: UApu5.5(A4) ; port D12
D13: UApu5.4(A3) ; port D13
D14: UApu5.3(A2) ; port D14
D15: UApu5.2(A1) ; port D15
DDIR_1: UApu1.130(IO,_LVDS8n) UApu4.1(DIR)
DDIR_2: UApu1.107(IO,_LVDS16n) UApu5.1(DIR)
DOE_1: UApu1.129(IO,_LVDS9p) UApu4.19(~{OE})
DOE_2: UApu1.108(IO,_LVDS16p) UApu5.19(~{OE})
Dpl00: UApu1.128(IO,_LVDS9n) UApu4.18(B1)
Dpl01: UApu1.127(IO,_LVDS10p) UApu4.17(B2)
Dpl02: UApu1.126(IO,_LVDS10n) UApu4.16(B3)
Dpl03: UApu1.125(IO,_VREF1B2) UApu4.15(B4)
Dpl04: UApu1.124(IO,_LVDS11p) UApu4.14(B5)
Dpl05: UApu1.123(IO,_LVDS11n_(DM0T)) UApu4.13(B6)
Dpl06: UApu1.122(IO,_LVDS12p) UApu4.12(B7)
Dpl07: UApu1.121(IO,_LVDS12n) UApu4.11(B8)
Dpl08: UApu1.120(IO,_VREF0B2) UApu5.11(B8)
Dpl09: UApu1.119(IO,_DPCLK3_(DQS0T)) UApu5.12(B7)
Dpl10: UApu1.114(IO,_LVDS13p_(DQ0T3)) UApu5.13(B6)
Dpl11: UApu1.113(IO,_LVDS13n_(DQ0T2)) UApu5.14(B5)
Dpl12: UApu1.112(IO,_LVDS14p_(DQ0T1)) UApu5.15(B4)
Dpl13: UApu1.111(IO,_LVDS14n_(DQ0T0)) UApu5.16(B3)
Dpl14: UApu1.110(IO,_LVDS15p) UApu5.17(B2)
Dpl15: UApu1.109(IO,_LVDS15n) UApu5.18(B1)
DS0*: UApu10.13(2A2) ; port DS0*
DS0*pl: UApu1.98(IO,_LVDS18n_(DQ1R2)) UApu10.7(2Y2)
DS1*: UApu10.11(2A1) ; port DS1*
DS1*pl: UApu1.99(IO,_LVDS18p_(DQ1R1)) UApu10.9(2Y1)
DTACK: UApu1.105(IO,_LVDS17n) UApu10.2(1A1)
DTACKpl: UApu10.18(1Y1) ; port DTACK  [project net DTACK]
FQuartz: UApu1.35(IO,_LVDS0p_(DQ1L7)) UG1.3(Out) UG2.2(IN)
IACK: UApu10.6(1A3) ; port IACK
IACKIN: UApu9.4(1A2) ; port IACKIN
IACKINpl: UApu1.84(IO,_LVDS19p_(DQ1R4)) UApu9.16(1Y2)
IACKOUT: UApu1.104(IO,_VREF0B3) UApu10.4(1A2)
IACKOUTpl: UApu10.16(1Y2) ; port IACKOUT  [project net IACKOUT]
IACKpl: UApu1.103(IO_(DQ1R0)) UApu10.14(1Y3)
IRQ1: UApu8.8(1A4) ; port IRQ1
IRQ2: UApu8.6(1A3) ; port IRQ2
IRQpl1: UApu1.75(IO,_LVDS21n) UApu8.12(1Y4)
IRQpl2: UApu1.76(IO,_LVDS21p) UApu8.14(1Y3)
LedClk: UApu1.27(IO,_PLL1_OUTn)
LedError: UApu1.31(IO,_VREF2B1)
LedTrigger: UApu1.28(IO,_DPCLK0_(DQS1L))
LWORD*: UApu10.15(2A3) ; port LWORD*
LWORD*pl: UApu1.97(IO_(DQ1R3)) UApu10.5(2Y3)
nCONFIG: RApu1.2 UApu1.14(nCONFIG) UApu3.5
nSTATUS: Rpu1.2 UApu1.87(nSTATUS)
PLL_Clock: UApu1.16(CLK0,_LVDSCLK1p) UG2.3(OUT) UG2.6(OUT)
PLLExtOut: UApu1.26(IO,_PLL1_OUTp)
PLLlocted: UApu1.33(IO,_LVDS1p_(DQ1L5))
SW_CL: UApu1.34(IO,_LVDS1n_(DQ1L6)) UG2.8(CONTROL)
SW_FL: UApu1.36(IO,_LVDS0n) UG2.1(CONTROL)
SyncroClk: UApu1.144(IO,_LVDS5p_(DEV_CLRn)) UG2.7(IN) ; port SyncroCLK
SYS_OE1: UApu1.94(IO) UApu10.1(1~{OE})
SYS_OE2: UApu1.106(IO,_LVDS17p) UApu10.19(2~{OE})
TCK: Rpu4.2 UApu1.88(TCK)
TDI: Rpu2.2 UApu1.95(TDI)
Test: UApu1.32(IO_(DQ1L4))
TMS: Rpu3.2 UApu1.89(TMS)
Trig+_ch1: UApu1.131(IO,_LVDS8p) ; port Trig+_ch1
Trig+_ch2: UApu1.132(IO) ; port Trig+_ch2
Trig+_ch3: UApu1.133(IO,_VREF2B2) ; port Trig+_ch3
Trig+_ch4: UApu1.134(IO,_DPCLK2_(DQS1T)) ; port Trig+_ch4
Trig+_ch5: UApu1.139(IO,_LVDS7n_(DQ0T4)) ; port Trig+_ch5
Trig+_ch6: UApu1.140(IO,_LVDS7p_(DQ0T5)) ; port Trig+_ch6
Trig+_ch7: UApu1.141(IO,_LVDS6n_(DQ0T6)) ; port Trig+_ch7
Trig+_ch8: UApu1.142(IO,_LVDS6p_(DQ0T7)) ; port Trig+_ch8
Trig+_ch9: UApu1.2(IO,_LVDS4n_(CRC_ERROR)/(DQ1L0)) ; port Trig+_ch9
Trig+_ch10: UApu1.3(IO,_LVDS3p_(CLKUSR)/(DQ1L1)) ; port Trig+_ch10
Trig+_ch11: UApu1.4(IO,_LVDS3n) ; port Trig+_ch11
Trig+_ch12: UApu1.5(IO,_VREF0B1) ; port Trig+_ch12
Trig+_ch13: UApu1.6(IO,_LVDS2p_(DQ1L2)) ; port Trig+_ch13
Trig+_ch14: UApu1.7(IO,_LVDS2n_(DQ1L3)) ; port Trig+_ch14
Trig+_ch15: UApu1.10(IO,_DPCLK1_(DQS0L)) ; port Trig+_ch15
Trig+_ch16: UApu1.11(IO,_VREF1B1) ; port Trig+_ch16
TrigIN: UApu1.143(IO,_LVDS5n_(DEV_OE)) ; port TrigIN
TrigOUT: UApu1.1(IO,_LVDS4p_(INIT_DONE)/(DM1L)) ; port TrigOUT
WRITE*: UApu10.17(2A4) ; port WRITE*
WRITE*pl: UApu1.96(IO,_VREF1B3) UApu10.3(2Y4)

Not connected (* = marked no-connect by the designer): UApu1 17(CLK1,_LVDSCLK1n) 20(nCEO) 90(TDO) 92(CLK3,_LVDSCLK2n) 93(CLK2,_LVDSCLK2p); UG1 1(OE)

### Notes on the sheet
- (in symbol EP1C3T144C8, part A) BANK 1
- (in symbol EP1C3T144C8, part B) BANK 2
- (in symbol EP1C3T144C8, part C) BANK 3
- (in symbol EP1C3T144C8, part D) BANK 4
- (in symbol MAX4651PP, part A) +; G
- (in symbol MAX4651PP, part B) +; G
- (in symbol SG-636) Crystal; Oscillator

### Library data of the parts
CApu1-CApu16 Cgen = C: Text Field1: 20; Text Field2: 10
RApu1-RApu3 Rpu1-Rpu4 = R: Text Field1: 20; Text Field2: 20
UApu1 = EP1C3T144C8: Cyclone Family, 1.5V FPGA, 104 I/O Pins, 1 x PLL, Commercial Grade, Speed Grade 8; Published: 17-Sep-2003; LatestRevisionDate: 13-Apr-2006; LatestRevisionNote: Pin 2 name fix, IPC-7351 Footprint Added.; DatasheetVersion: ver2.4, May-2008; PackageVersion: ver15.4, Dec-2008; PackageReference: TQFP144; Publisher: Altium Limited; PackageDescription: 144-Pin Plastic Thin Quad Flat Pack (TQFP144) - Wire Bond; Supplier 1: Digi-Key; Supplier Part Number 1: 544-1052-ND; Code_JEDEC: MS-026-BFB; ComponentLink1Description: Manufacturer Link; ComponentLink1URL: http://www.altera.com/products/devices/cyclone/cyc-index.jsp; ComponentLink2Description: Handbook; ComponentLink2URL: http://www.altera.com/literature/hb/cyc/cyc_c5v1.pdf; ComponentLink3Description: Packaging Specification; ComponentLink3URL: http://www.altera.com/literature/ds/dspkg.pdf
UApu2 = EPCS1: Serial configuration device for Cyclone (Altera)
UApu3 = IDC-10: Text Field1: 40; Text Field2: 60
UApu4 UApu5 = SN74ALS645A-1DW: Octal Bus Transceiver with 3-State Outputs; Published: 8-Jun-2000; LatestRevisionDate: 13-Apr-2006; LatestRevisionNote: IPC-7351 Footprint Added.; DatasheetVersion: Jan-1995; PackageVersion: Mar-2000; PackageReference: DW020; Publisher: Altium Limited; PackageDescription: 20-Pin Plastic Small Outline Integrated Circuit 1.27 mm Pitch; Code_JEDEC: MS-013; Code_IPC: SOIC127P1030-20; ComponentLink1Description: Manufacturer Link; ComponentLink1URL: http://www.ti.com/; ComponentLink2Description: Datasheet; ComponentLink2URL: http://www-s.ti.com/sc/ds/sn74als645a.pdf
UApu6-UApu10 = SN74LS244DW: Octal Buffer and Line Driver with 3-State Outputs; ComponentAvailability: Obsolete; Published: 8-Jun-2000; LatestRevisionDate: 13-Apr-2006; LatestRevisionNote: IPC-7351 Footprint Added.; DatasheetVersion: Mar-1988; PackageVersion: Mar-2000; PackageReference: DW020; Publisher: Altium Limited; PackageDescription: 20-Pin Plastic Small Outline Integrated Circuit 1.27 mm Pitch; Code_JEDEC: MS-013; Code_IPC: SOIC127P1030-20; ComponentLink1Description: Manufacturer Link; ComponentLink1URL: http://www.ti.com/; ComponentLink2Description: Datasheet; ComponentLink2URL: http://www-s.ti.com/sc/ds/sn74ls240.pdf
UG1 = SG-636: Crystal Oscillator (SMD)
UG2 = MAX4651PP: Text Field1: 20; Text Field2: 40

## Nets that join several sheets
+1.5 Vdig: Supply (Csup11.+ Csup12.1 Usup2.2 Usup2.4), Processing (10 pins)
+3.3 Vdig: Supply (Csup7.+ Csup8.1 Usup1.2 Usup1.4), Processing (31 pins)
+5 V: Supply (Csup3.+ Csup4.1 Lref2.2), Conv_Ch1 (C3_Conv_Ch1.2 C4_Conv_Ch1.+ Rvar1_Conv_Ch1.1 U3_Conv_Ch1.8), Conv_Ch2 (C3_Conv_Ch2.2 C4_Conv_Ch2.+ Rvar1_Conv_Ch2.1 U3_Conv_Ch2.8), Conv_Ch3 (C3_Conv_Ch3.2 C4_Conv_Ch3.+ Rvar1_Conv_Ch3.1 U3_Conv_Ch3.8), Conv_Ch4 (C3_Conv_Ch4.2 C4_Conv_Ch4.+ Rvar1_Conv_Ch4.1 U3_Conv_Ch4.8), Processing (7 pins), Conv_Ch5 (C3_Conv_Ch5.2 C4_Conv_Ch5.+ Rvar1_Conv_Ch5.1 U3_Conv_Ch5.8), Conv_Ch6 (C3_Conv_Ch6.2 C4_Conv_Ch6.+ Rvar1_Conv_Ch6.1 U3_Conv_Ch6.8), Conv_Ch7 (C3_Conv_Ch7.2 C4_Conv_Ch7.+ Rvar1_Conv_Ch7.1 U3_Conv_Ch7.8), Conv_Ch8 (C3_Conv_Ch8.2 C4_Conv_Ch8.+ Rvar1_Conv_Ch8.1 U3_Conv_Ch8.8), Conv_Ch9 (C3_Conv_Ch9.2 C4_Conv_Ch9.+ Rvar1_Conv_Ch9.1 U3_Conv_Ch9.8), Conv_Ch10 (C3_Conv_Ch10.2 C4_Conv_Ch10.+ Rvar1_Conv_Ch10.1 U3_Conv_Ch10.8), Conv_Ch11 (C3_Conv_Ch11.2 C4_Conv_Ch11.+ Rvar1_Conv_Ch11.1 U3_Conv_Ch11.8), Conv_Ch12 (C3_Conv_Ch12.2 C4_Conv_Ch12.+ Rvar1_Conv_Ch12.1 U3_Conv_Ch12.8), Conv_Ch13 (C3_Conv_Ch13.2 C4_Conv_Ch13.+ Rvar1_Conv_Ch13.1 U3_Conv_Ch13.8), Conv_Ch14 (C3_Conv_Ch14.2 C4_Conv_Ch14.+ Rvar1_Conv_Ch14.1 U3_Conv_Ch14.8), Conv_Ch15 (C3_Conv_Ch15.2 C4_Conv_Ch15.+ Rvar1_Conv_Ch15.1 U3_Conv_Ch15.8), Conv_Ch16 (C3_Conv_Ch16.2 C4_Conv_Ch16.+ Rvar1_Conv_Ch16.1 U3_Conv_Ch16.8)
+5in V: Supply (Lref2.1 Lref3.1), In-Out (7 pins)
+12in V: Supply (Lref1.1), In-Out (VME-BUS/J1.C31)
GND: Supply (14 pins), In-Out (50 pins), Conv_Ch1 (7 pins), Conv_Ch2 (7 pins), Conv_Ch3 (7 pins), Conv_Ch4 (7 pins), Processing (47 pins), Conv_Ch5 (7 pins), Conv_Ch6 (7 pins), Conv_Ch7 (7 pins), Conv_Ch8 (7 pins), Conv_Ch9 (7 pins), Conv_Ch10 (7 pins), Conv_Ch11 (7 pins), Conv_Ch12 (7 pins), Conv_Ch13 (7 pins), Conv_Ch14 (7 pins), Conv_Ch15 (7 pins), Conv_Ch16 (7 pins)
A01: In-Out (VME-BUS/J1.A30), Processing (UApu6.4)
A02: In-Out (VME-BUS/J1.A29), Processing (UApu6.6)
A03: In-Out (VME-BUS/J1.A28), Processing (UApu6.8)
A04: In-Out (VME-BUS/J1.A27), Processing (UApu6.11)
A05: In-Out (VME-BUS/J1.A26), Processing (UApu6.13)
A06: In-Out (VME-BUS/J1.A25), Processing (UApu6.15)
A07: In-Out (VME-BUS/J1.A24), Processing (UApu6.17)
A08: In-Out (VME-BUS/J1.C30), Processing (UApu6.2)
A09: In-Out (VME-BUS/J1.C29), Processing (UApu7.2)
A10: In-Out (VME-BUS/J1.C28), Processing (UApu7.4)
A11: In-Out (VME-BUS/J1.C27), Processing (UApu7.6)
A12: In-Out (VME-BUS/J1.C26), Processing (UApu7.8)
A13: In-Out (VME-BUS/J1.C25), Processing (UApu7.17)
A14: In-Out (VME-BUS/J1.C24), Processing (UApu7.15)
A15: In-Out (VME-BUS/J1.C23), Processing (UApu7.13)
A16: In-Out (VME-BUS/J1.C22), Processing (UApu7.11)
A17: In-Out (VME-BUS/J1.C21), Processing (UApu9.2)
A18: In-Out (VME-BUS/J1.C20), Processing (UApu9.6)
A19: In-Out (VME-BUS/J1.C19), Processing (UApu9.8)
A20: In-Out (VME-BUS/J1.C18), Processing (UApu9.17)
A21: In-Out (VME-BUS/J1.C17), Processing (UApu9.15)
A22: In-Out (VME-BUS/J1.C16), Processing (UApu9.13)
A23: In-Out (VME-BUS/J1.C15), Processing (UApu9.11)
AM0: In-Out (VME-BUS/J1.B16), Processing (UApu8.15)
AM1: In-Out (VME-BUS/J1.B17), Processing (UApu8.13)
AM2: In-Out (VME-BUS/J1.B18), Processing (UApu8.11)
AM3: In-Out (VME-BUS/J1.B19), Processing (UApu8.4)
AM4: In-Out (VME-BUS/J1.A23), Processing (UApu8.2)
AM5: In-Out (VME-BUS/J1.C14), Processing (UApu8.17)
AS: In-Out (VME-BUS/J1.A18), Processing (UApu10.8)
D00: In-Out (VME-BUS/J1.A1), Processing (UApu4.2)
D01: In-Out (VME-BUS/J1.A2), Processing (UApu4.3)
D02: In-Out (VME-BUS/J1.A3), Processing (UApu4.4)
D03: In-Out (VME-BUS/J1.A4), Processing (UApu4.5)
D04: In-Out (VME-BUS/J1.A5), Processing (UApu4.6)
D05: In-Out (VME-BUS/J1.A6), Processing (UApu4.7)
D06: In-Out (VME-BUS/J1.A7), Processing (UApu4.8)
D07: In-Out (VME-BUS/J1.A8), Processing (UApu4.9)
D08: In-Out (VME-BUS/J1.C1), Processing (UApu5.9)
D09: In-Out (VME-BUS/J1.C2), Processing (UApu5.8)
D10: In-Out (VME-BUS/J1.C3), Processing (UApu5.7)
D11: In-Out (VME-BUS/J1.C4), Processing (UApu5.6)
D12: In-Out (VME-BUS/J1.C5), Processing (UApu5.5)
D13: In-Out (VME-BUS/J1.C6), Processing (UApu5.4)
D14: In-Out (VME-BUS/J1.C7), Processing (UApu5.3)
D15: In-Out (VME-BUS/J1.C8), Processing (UApu5.2)
DS0*: In-Out (VME-BUS/J1.A13), Processing (UApu10.13)
DS1*: In-Out (VME-BUS/J1.A12), Processing (UApu10.11)
DTACK: In-Out (VME-BUS/J1.A16), Processing (UApu10.18)
IACK: In-Out (VME-BUS/J1.A20), Processing (UApu10.6)
IACKIN: In-Out (VME-BUS/J1.A21), Processing (UApu9.4)
IACKOUT: In-Out (VME-BUS/J1.A22), Processing (UApu10.16)
IRQ1: In-Out (VME-BUS/J1.B30), Processing (UApu8.8)
IRQ2: In-Out (VME-BUS/J1.B29), Processing (UApu8.6)
LWORD*: In-Out (VME-BUS/J1.C13), Processing (UApu10.15)
Sum_ch1: In-Out (SumIn_1.5), Conv_Ch1 (U3_Conv_Ch1.2)
Sum_ch2: In-Out (SumIn_1.4), Conv_Ch2 (U3_Conv_Ch2.2)
Sum_ch3: In-Out (SumIn_1.3), Conv_Ch3 (U3_Conv_Ch3.2)
Sum_ch4: In-Out (SumIn_1.2), Conv_Ch4 (U3_Conv_Ch4.2)
Sum_ch5: In-Out (SumIn_2.5), Conv_Ch5 (U3_Conv_Ch5.2)
Sum_ch6: In-Out (SumIn_2.4), Conv_Ch6 (U3_Conv_Ch6.2)
Sum_ch7: In-Out (SumIn_2.3), Conv_Ch7 (U3_Conv_Ch7.2)
Sum_ch8: In-Out (SumIn_2.2), Conv_Ch8 (U3_Conv_Ch8.2)
Sum_ch9: In-Out (SumIn_3.5), Conv_Ch9 (U3_Conv_Ch9.2)
Sum_ch10: In-Out (SumIn_3.4), Conv_Ch10 (U3_Conv_Ch10.2)
Sum_ch11: In-Out (SumIn_3.3), Conv_Ch11 (U3_Conv_Ch11.2)
Sum_ch12: In-Out (SumIn_3.2), Conv_Ch12 (U3_Conv_Ch12.2)
Sum_ch13: In-Out (SumIn_4.5), Conv_Ch13 (U3_Conv_Ch13.2)
Sum_ch14: In-Out (SumIn_4.4), Conv_Ch14 (U3_Conv_Ch14.2)
Sum_ch15: In-Out (SumIn_4.3), Conv_Ch15 (U3_Conv_Ch15.2)
Sum_ch16: In-Out (SumIn_4.2), Conv_Ch16 (U3_Conv_Ch16.2)
SyncroClk: In-Out (SyncroClk.1), Processing (UApu1.144 UG2.7)
Trig+_ch1: Conv_Ch1 (C5_Conv_Ch1.2 U3_Conv_Ch1.6), Processing (UApu1.131)
Trig+_ch2: Conv_Ch2 (C5_Conv_Ch2.2 U3_Conv_Ch2.6), Processing (UApu1.132)
Trig+_ch3: Conv_Ch3 (C5_Conv_Ch3.2 U3_Conv_Ch3.6), Processing (UApu1.133)
Trig+_ch4: Conv_Ch4 (C5_Conv_Ch4.2 U3_Conv_Ch4.6), Processing (UApu1.134)
Trig+_ch5: Processing (UApu1.139), Conv_Ch5 (C5_Conv_Ch5.2 U3_Conv_Ch5.6)
Trig+_ch6: Processing (UApu1.140), Conv_Ch6 (C5_Conv_Ch6.2 U3_Conv_Ch6.6)
Trig+_ch7: Processing (UApu1.141), Conv_Ch7 (C5_Conv_Ch7.2 U3_Conv_Ch7.6)
Trig+_ch8: Processing (UApu1.142), Conv_Ch8 (C5_Conv_Ch8.2 U3_Conv_Ch8.6)
Trig+_ch9: Processing (UApu1.2), Conv_Ch9 (C5_Conv_Ch9.2 U3_Conv_Ch9.6)
Trig+_ch10: Processing (UApu1.3), Conv_Ch10 (C5_Conv_Ch10.2 U3_Conv_Ch10.6)
Trig+_ch11: Processing (UApu1.4), Conv_Ch11 (C5_Conv_Ch11.2 U3_Conv_Ch11.6)
Trig+_ch12: Processing (UApu1.5), Conv_Ch12 (C5_Conv_Ch12.2 U3_Conv_Ch12.6)
Trig+_ch13: Processing (UApu1.6), Conv_Ch13 (C5_Conv_Ch13.2 U3_Conv_Ch13.6)
Trig+_ch14: Processing (UApu1.7), Conv_Ch14 (C5_Conv_Ch14.2 U3_Conv_Ch14.6)
Trig+_ch15: Processing (UApu1.10), Conv_Ch15 (C5_Conv_Ch15.2 U3_Conv_Ch15.6)
Trig+_ch16: Processing (UApu1.11), Conv_Ch16 (C5_Conv_Ch16.2 U3_Conv_Ch16.6)
TrigIN: In-Out (TrigIN.1), Processing (UApu1.143)
TrigOUT: In-Out (TrigOUT.1), Processing (UApu1.1)
WRITE*: In-Out (VME-BUS/J1.A14), Processing (UApu10.17)